# Altium schematic sheet LIDO-HW.200.MCU_Peripherals_2.SchDoc
size A3; SheetNumber: 11; SheetTotal: 17
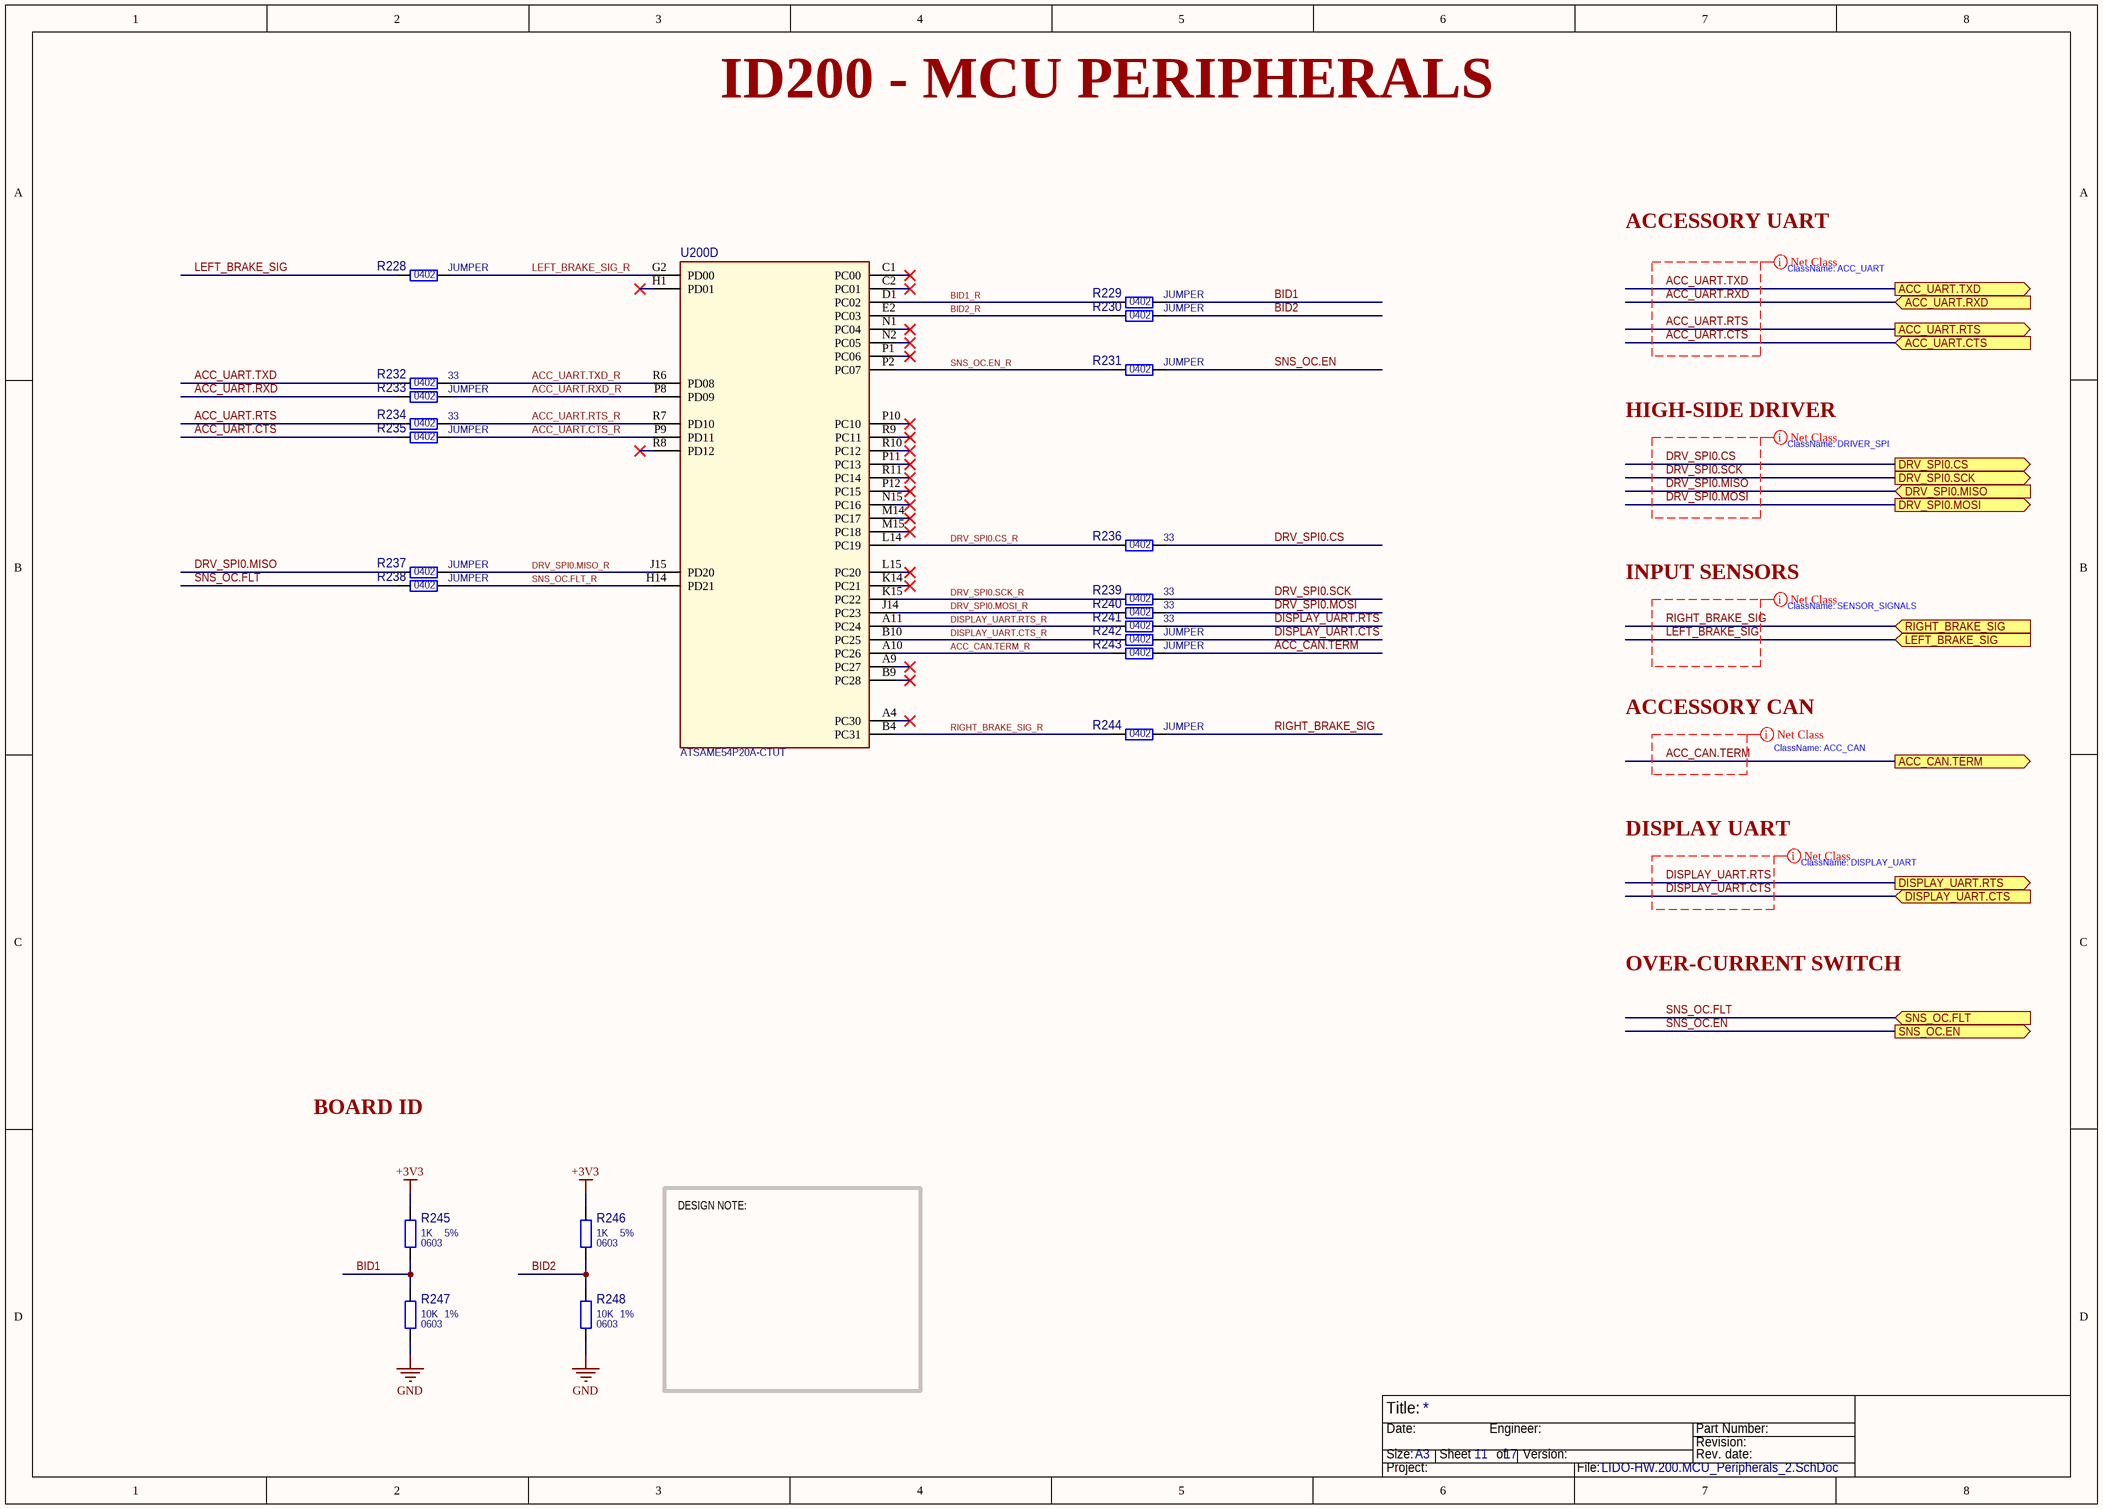
[diagram p0: LIDO-HW.200.MCU_Peripherals_2.SchDoc]

## Parts
R228  JUMPER  Part Package: 0402  [RES_0402_1005X40-N_YAGEO_A]
R229  JUMPER  Part Package: 0402  [RES_0402_1005X40-N_YAGEO_A]
R230  JUMPER  Part Package: 0402  [RES_0402_1005X40-N_YAGEO_A]
R231  JUMPER  Part Package: 0402  [RES_0402_1005X40-N_YAGEO_A]
R232  33  Part Package: 0402  [RES_0402_1005X40-N_YAGEO_A]
R233  JUMPER  Part Package: 0402  [RES_0402_1005X40-N_YAGEO_A]
R234  33  Part Package: 0402  [RES_0402_1005X40-N_YAGEO_A]
R235  JUMPER  Part Package: 0402  [RES_0402_1005X40-N_YAGEO_A]
R236  33  Part Package: 0402  [RES_0402_1005X40-N_YAGEO_A]
R237  JUMPER  Part Package: 0402  [RES_0402_1005X40-N_YAGEO_A]
R238  JUMPER  Part Package: 0402  [RES_0402_1005X40-N_YAGEO_A]
R239  33  Part Package: 0402  [RES_0402_1005X40-N_YAGEO_A]
R240  33  Part Package: 0402  [RES_0402_1005X40-N_YAGEO_A]
R241  33  Part Package: 0402  [RES_0402_1005X40-N_YAGEO_A]
R242  JUMPER  Part Package: 0402  [RES_0402_1005X40-N_YAGEO_A]
R243  JUMPER  Part Package: 0402  [RES_0402_1005X40-N_YAGEO_A]
R244  JUMPER  Part Package: 0402  [RES_0402_1005X40-N_YAGEO_A]
R245  1K  Part Value 2: 5%  Part Package: 0603  [RES_0603_1608X60-N_YAGEO_A]
R246  1K  Part Value 2: 5%  Part Package: 0603  [RES_0603_1608X60-N_YAGEO_A]
R247  10K  Part Value 2: 1%  Part Package: 0603  [RES_0603_1608X60-N_YAGEO_A]
R248  10K  Part Value 2: 1%  Part Package: 0603  [RES_0603_1608X60-N_YAGEO_A]
U200  ATSAME54P20A-CTUT  [BGA120CP50_15X15_800X800X120B25-N_MICROCHIP_A]  (part D of 4)

## Ports
ACC_CAN.TERM (out), ACC_UART.CTS (in), ACC_UART.RTS (out), ACC_UART.RXD (in), ACC_UART.TXD (out), DISPLAY_UART.CTS (in), DISPLAY_UART.RTS (out), DRV_SPI0.CS (out), DRV_SPI0.MISO (in), DRV_SPI0.MOSI (out), DRV_SPI0.SCK (out), LEFT_BRAKE_SIG (in), RIGHT_BRAKE_SIG (in), SNS_OC.EN (out), SNS_OC.FLT (in)

## Nets
+3V3: R245.2 R246.2
GND: R247.1 R248.1
ACC_CAN.TERM: R243.2 ; port ACC_CAN.TERM
ACC_CAN.TERM_R: R243.1 U200.A10(PC26)
ACC_UART.CTS: R235.1 ; port ACC_UART.CTS
ACC_UART.CTS_R: R235.2 U200.P9(PD11)
ACC_UART.RTS: R234.1 ; port ACC_UART.RTS
ACC_UART.RTS_R: R234.2 U200.R7(PD10)
ACC_UART.RXD: R233.1 ; port ACC_UART.RXD
ACC_UART.RXD_R: R233.2 U200.P8(PD09)
ACC_UART.TXD: R232.1 ; port ACC_UART.TXD
ACC_UART.TXD_R: R232.2 U200.R6(PD08)
BID1: R229.2 R245.1 R247.2
BID1_R: R229.1 U200.D1(PC02)
BID2: R230.2 R246.1 R248.2
BID2_R: R230.1 U200.E2(PC03)
DISPLAY_UART.CTS: R242.2 ; port DISPLAY_UART.CTS
DISPLAY_UART.CTS_R: R242.1 U200.B10(PC25)
DISPLAY_UART.RTS: R241.2 ; port DISPLAY_UART.RTS
DISPLAY_UART.RTS_R: R241.1 U200.A11(PC24)
DRV_SPI0.CS: R236.2 ; port DRV_SPI0.CS
DRV_SPI0.CS_R: R236.1 U200.L14(PC19)
DRV_SPI0.MISO: R237.1 ; port DRV_SPI0.MISO
DRV_SPI0.MISO_R: R237.2 U200.J15(PD20)
DRV_SPI0.MOSI: R240.2 ; port DRV_SPI0.MOSI
DRV_SPI0.MOSI_R: R240.1 U200.J14(PC23)
DRV_SPI0.SCK: R239.2 ; port DRV_SPI0.SCK
DRV_SPI0.SCK_R: R239.1 U200.K15(PC22)
LEFT_BRAKE_SIG: R228.1 ; port LEFT_BRAKE_SIG
LEFT_BRAKE_SIG_R: R228.2 U200.G2(PD00)
RIGHT_BRAKE_SIG: R244.2 ; port RIGHT_BRAKE_SIG
RIGHT_BRAKE_SIG_R: R244.1 U200.B4(PC31)
SNS_OC.EN: R231.2 ; port SNS_OC.EN
SNS_OC.EN_R: R231.1 U200.P2(PC07)
SNS_OC.FLT: R238.1 ; port SNS_OC.FLT
SNS_OC.FLT_R: R238.2 U200.H14(PD21)

Not connected (* = marked no-connect by the designer): U200 A4(PC30)* A9(PC27)* B9(PC28)* C1(PC00)* C2(PC01)* H1(PD01)* K14(PC21)* L15(PC20)* M14(PC17)* M15(PC18)* N1(PC04)* N2(PC05)* N15(PC16)* P1(PC06)* P10(PC10)* P11(PC13)* P12(PC15)* R8(PD12)* R9(PC11)* R10(PC12)* R11(PC14)*

## Layout directives
net class ACC_UART: ACC_UART.CTS, ACC_UART.RTS, ACC_UART.RXD, ACC_UART.TXD
net class DRIVER_SPI: DRV_SPI0.CS, DRV_SPI0.MISO, DRV_SPI0.MOSI, DRV_SPI0.SCK
net class DISPLAY_UART: DISPLAY_UART.CTS, DISPLAY_UART.RTS
net class SENSOR_SIGNALS: LEFT_BRAKE_SIG, RIGHT_BRAKE_SIG
net class ACC_CAN: ACC_CAN.TERM

## Notes on the sheet
- ID200 - MCU PERIPHERALS
- ACCESSORY UART
- ClassName: ACC_UART
- HIGH-SIDE DRIVER
- ClassName: DRIVER_SPI
- INPUT SENSORS
- ClassName: SENSOR_SIGNALS
- ACCESSORY CAN
- ClassName: ACC_CAN
- DISPLAY UART
- ClassName: DISPLAY_UART
- OVER-CURRENT SWITCH
- BOARD ID
- DESIGN NOTE:
- Title:
- Size:
- Date:
- A3
- Sheet       of
- Engineer:
- Version:
- Part Number:
- Revision:
- Rev. date:
- Project:
- File:

## Library data of the parts
R228-R231 R233 R235 R237 R238 R242-R244 = 127: RES SMD 0 OHM JUMPER 1/10W 0402; Manufacturer Part Number: ERJ-2GE0R00X; Manufacturer: Panasonic Electronic Components; Obsolete Part: False; Component ID: 127; Part Value: JUMPER; Part Value 3: 1/10W; Package Type: SMT
R232 R234 R236 R239-R241 = 111: RES SMD 33 OHM 5% 1/10W 0402; Manufacturer Part Number: ERJ-2GEJ330X; Manufacturer: Panasonic Electronic Components; Obsolete Part: False; Component ID: 111; Part Value: 33; Part Value 2: 5%; Part Value 3: 1/10W; Package Type: SMT
R245 R246 = 113: RES 1K OHM 5% 1/10W 0603; Manufacturer Part Number: RC0603JR-071KL; Manufacturer: YAGEO; Obsolete Part: False; Component ID: 113; Part Value: 1K; Part Value 3: 1/10W; Package Type: SMT
R247 R248 = 115: RES 10K OHM 1% 1/10W 0603; Manufacturer Part Number: RC0603FR-0710KL; Manufacturer: YAGEO; Obsolete Part: False; Component ID: 115; Part Value: 10K; Part Value 3: 1/10W; Package Type: SMT
U200 = 10: ARM® Cortex®-M4F series Microcontroller IC 32-Bit Single-Core 120MHz 1MB (1M x 8) FLASH 120-TFBGA (8x8); Manufacturer: Microchip Technology; Part Package: TFBGA-120; Obsolete Part: False; Component ID: 10; Manufacturer Part Number: ATSAME54P20A-CTUT; Part Type: MCU M4; Package Type: SMT